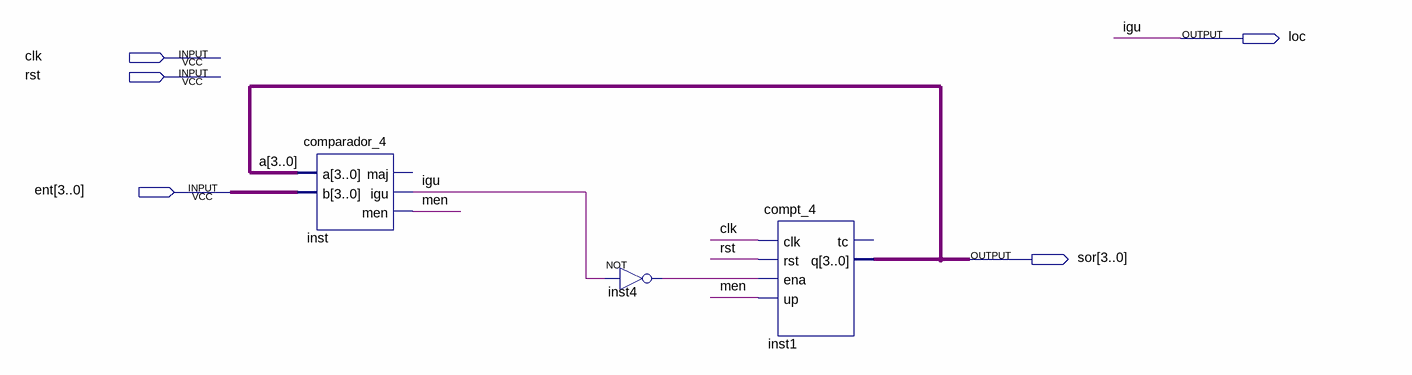
[diagram p0: schematic sheet]
// Quartus schematic 2017TG21.bdf as structural Verilog: 3 symbols, 5 pins
module \2017TG21  (
  input  clk,
  input  rst,
  input  [3:0] ent,
  output loc,
  output [3:0] sor
);

  wire inst4_out, men;

  comparador_4 inst (.a(sor), .b(ent), .igu(loc), .men(men));  // open: maj
  not inst4 (inst4_out, loc);
  compt_4 inst1 (.clk(clk), .rst(rst), .ena(inst4_out), .up(men), .q(sor));  // open: tc

  // Other names for the same wires on the sheet: igu = loc; a[3:0] = sor
endmodule
